# EAGLE schematic SDCardv1 (EAGLE 6.0)
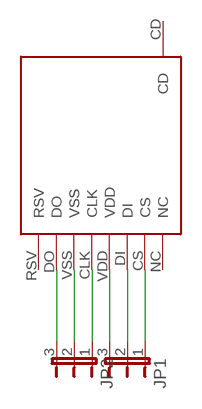
[diagram p0: schematic, sheet 1]

## Parts
JP1  JP2W  [JP2W]
JP2  JP2W  [JP2W]
U$1  MICROSD_SOCKET  [MICROSD_SOCKET]

## Nets
N$1: JP1.1 U$1.CS
N$2: JP1.2 U$1.DI
N$3: JP1.3 U$1.VDD
N$4: JP2.1 U$1.CLK
N$5: JP2.2 U$1.VSS
N$6: JP2.3 U$1.DO
Unconnected: U$1.CD U$1.NC U$1.RSV

## Library data of the parts
JP1 JP2 = jumper:JP2W: JUMPER
U$1 = ekohub2013:MICROSD_SOCKET